# EasyEDA Pro project ProPrj_Desktop_Pet_Dog_V1.3.epro, board PCB5_1
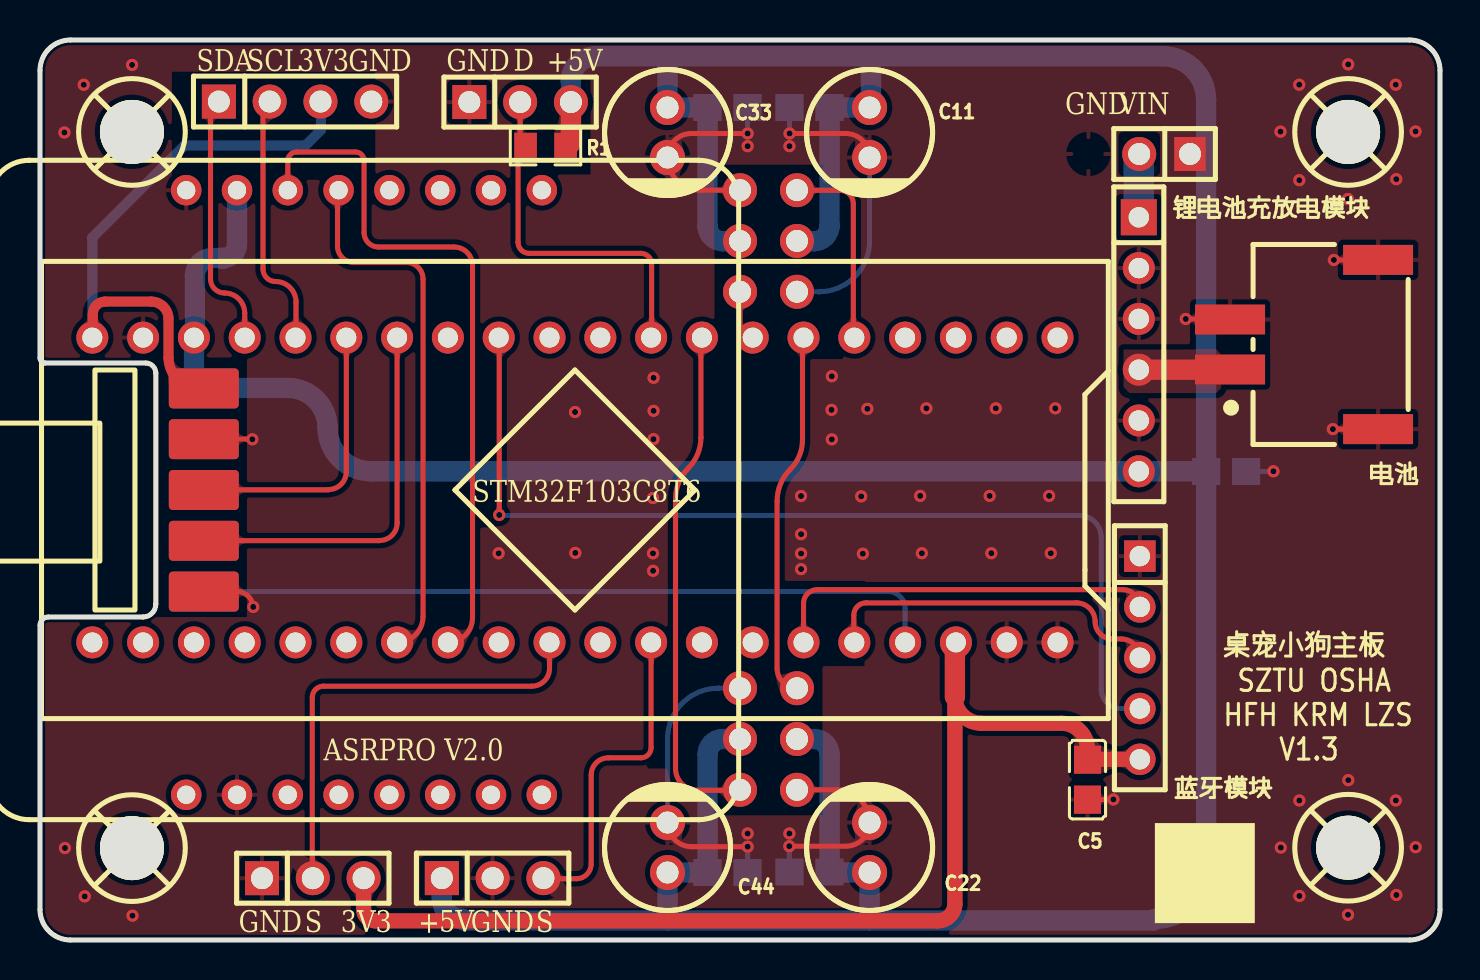
[diagram p5: board, top side]
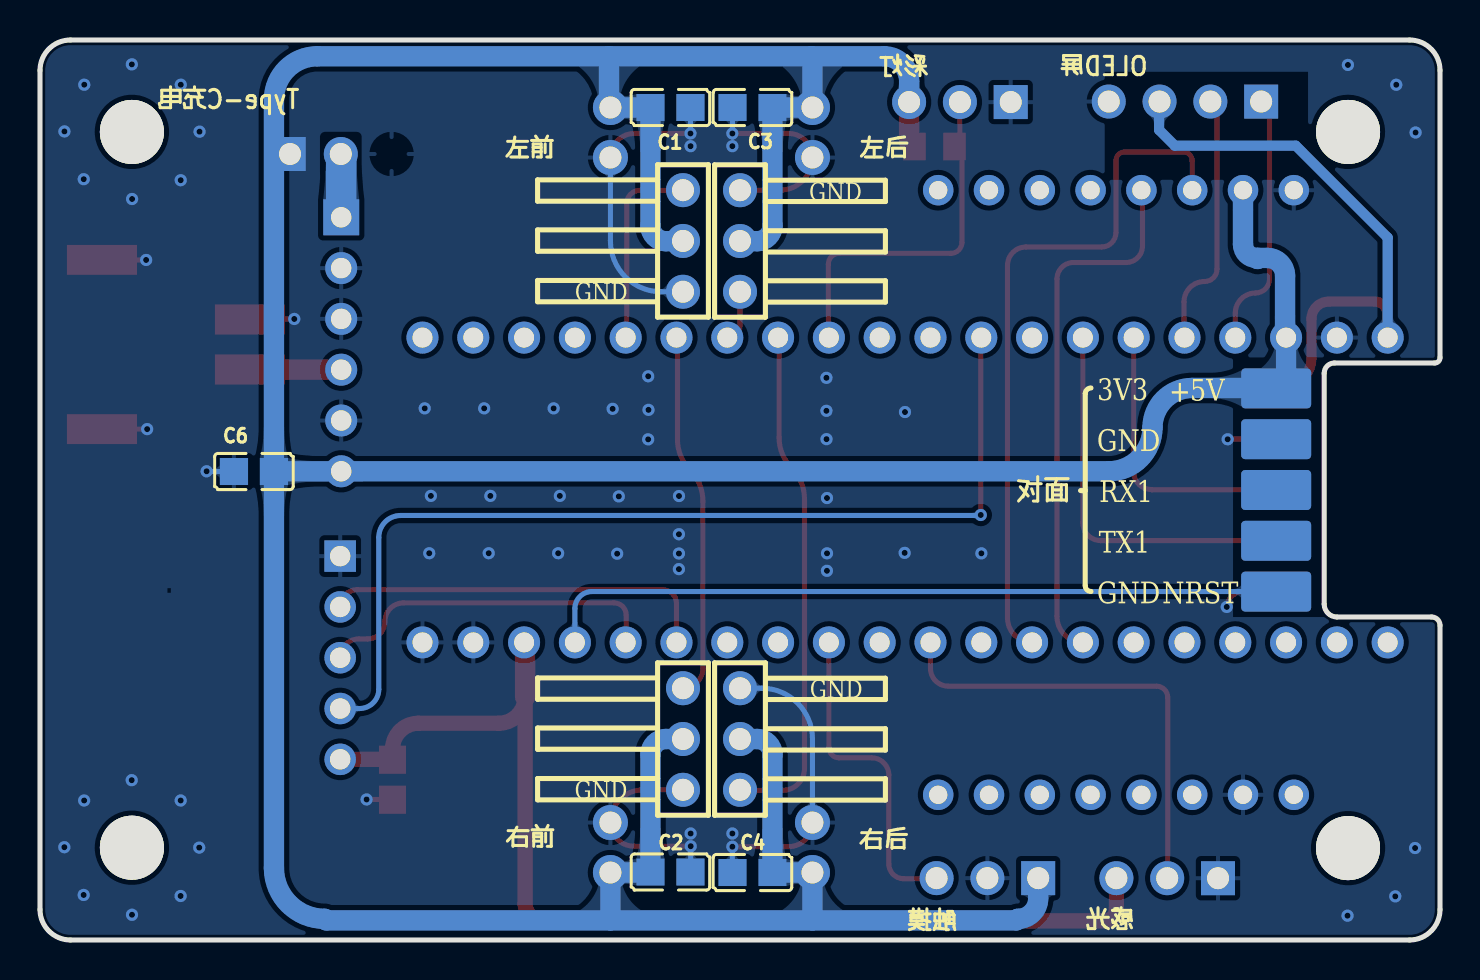
[diagram p6: board, bottom side, seen from below]

Outline 70 x 45 mm; copper layers: Top Layer, Bottom Layer. Coordinates in mm from the lower left corner of the outline.
Outline path: 0,43.48 0,29.11 arc(0.08,28.93) 0.26,28.85 5.28,28.85 arc(5.64,28.7) 5.79,28.34 5.79,16.8 arc(5.6,16.34) 5.15,16.15 0.42,16.15 arc(0.12,16.03) 0,15.73 0,1.52 arc(0.45,0.45) 1.52,0 68.48,0 arc(69.55,0.45) 70,1.52 70,43.48 arc(69.55,44.55) 68.48,45 1.52,45 arc(0.45,44.55) 0,43.48
Stack: Top Layer 0.035mm / Dielectric1 1.51mm FR4 er 4.5 / Bottom Layer 0.035mm

## Design rules (mm)
template: 自定义配置
spacing copperThickness1oz (default): track to track 0.102, other pairs 0 to 0.3
spacing copperThickness2oz: track to track 0.203, other pairs 0.152 to 0.3
track width copperThickness1oz (default): min 0.127, default 0.254, max 2.54
track width copperThickness2oz: min 0.203, default 0.254, max 2.54
differential pair differentialPair (default): width min 0.127, default 0.254, max 2.54; gap min 0.152, default 0.152
via viaSize (default): diameter min 0.5, default 0.61, max 10; hole min 0.3, default 0.305, max 6.3

## Placement (name value [footprint] x y rotation side)
C1  100nF  [C0805]  38.48 41.62 180 bottom
C2  100nF  [C0805]  38.48 3.4 180 bottom
C3  100nF  [C0805]  34.38 41.62 0 bottom
C4  100nF  [C0805]  34.38 3.37 0 bottom
C5  10uF  [C0805]  52.38 8.02 270 top
C6  100nF  [C0805]  59.3 23.42 0 bottom
C11  100uF  [CAP-TH_BD6.3-P2.50-D0.6-FD]  41.48 40.38 270 top
C22  100uF  [CAP-TH_BD6.3-P2.50-D0.6-FD]  41.48 4.62 90 top
C33  100uF  [CAP-TH_BD6.3-P2.50-D0.6-FD]  31.38 40.38 270 top
C44  100uF  [CAP-TH_BD6.3-P2.50-D0.6-FD]  31.38 4.62 90 top
H1  PZ254V-12-10P  [HDR-TH_10P-P2.54-V-M-R2-C5-S2.54]  1.36 22.5 90 bottom
OLED屏  -  [HDR-TH_4P-P2.54-V-M]  12.75 41.92 0 top
R1  4.7kΩ  [R0805]  25.28 39.67 180 top
SCREW1  -  [M3螺丝]  4.6 40.4 0 top
SCREW2  -  [M3螺丝]  65.41 40.4 0 top
SCREW3  -  [M3螺丝]  65.41 4.61 0 top
SCREW4  -  [M3螺丝]  4.6 4.59 0 top
Type-C充电  -  [单排针2P-2.54]  53.69 39.3 180 top
U1  STM32F103C8T6-Card  [CONN-TH_L53.3-W22.9_STM32F103C8T6-CARD]  26.75 22.5 180 top
U2  -  [天问模块]  16.2 22.5 0 top
U3  -  [JLC-QRCODE-5x5]  58.24 3.34 0 top
U4  -  [OSHA]  63.53 19.37 0 top
U5  -  [剑桥大学校徽]  109.56 21.79 180 bottom
右前  2.54-1*3P正弯针  [HDR-TH_3P-P2.54-H-M-BW7.2-P]  37.85 10.05 270 bottom
右后  2.54-1*3P正弯针  [HDR-TH_3P-P2.54-H-M-BW7.2-P]  35 10.05 90 bottom
左前  2.54-1*3P正弯针  [HDR-TH_3P-P2.54-H-M-BW7.2-P]  37.85 34.95 270 bottom
左后  2.54-1*3P正弯针  [HDR-TH_3P-P2.54-H-M-BW7.2-P]  35 34.95 90 bottom
彩灯  PZ254V-11-03P  [HDR-TH_3P-P2.54-V-M]  24.01 41.9 0 top
感光  PZ254V-11-03P  [HDR-TH_3P-P2.54-V-M]  13.64 3.09 0 top
电池  ZX-XH2.54-2PWT  [CONN-SMD_2P-P2.54_MEGASTAR_ZX-XH2.54-2PWT]  63.2 29.78 90 top
蓝牙模块  2.54-1*5P母  [HDR-TH_5P-P2.54-V-F]  54.99 14.11 270 top
触摸  PZ254V-11-03P  [HDR-TH_3P-P2.54-V-M]  22.63 3.09 0 top
锂电池充放电模块  PM254V-11-06-H85  [HDR-TH_6P-P2.54-V-F]  54.94 29.79 270 top

## Footprints (pads in the part's own frame, mm; a bottom-side part is the same pattern mirrored in y, then rotated)
C0805
  rect 1.41x1.35 smd: 1(-1,0) 2(1,0)
CAP-TH_BD6.3-P2.50-D0.6-FD
  round 1.75 hole 1.1: 1(-1.25,0) 2(1.25,0)
CONN-SMD_2P-P2.54_MEGASTAR_ZX-XH2.54-2PWT
  rect 1.5x3.5 smd: 1(-1.25,3.7) 2(1.25,3.7) 3(-4.23,-3.7) 4(4.23,-3.7)
CONN-TH_L53.3-W22.9_STM32F103C8T6-CARD
  round 1.6 hole 1: 1(-24.13,-7.62) 2(-21.59,-7.62) 3(-19.05,-7.62) 4(-16.51,-7.62) 5(-13.97,-7.62) 6(-11.43,-7.62) 7(-8.89,-7.62) 8(-6.35,-7.62) 9(-3.81,-7.62) 10(-1.27,-7.62) 11(1.27,-7.62) 12(3.81,-7.62) 13(6.35,-7.62) 14(8.89,-7.62) 15(11.43,-7.62) 16(13.97,-7.62) 17(16.51,-7.62) 18(19.05,-7.62) 19(21.59,-7.62) 20(24.13,-7.62) 21(24.13,7.62) 22(21.59,7.62) 23(19.05,7.62) 24(16.51,7.62) 25(13.97,7.62) 26(11.43,7.62) 27(8.89,7.62) 28(6.35,7.62) 29(3.81,7.62) 30(1.27,7.62) 31(-1.27,7.62) 32(-3.81,7.62) 33(-6.35,7.62) 34(-8.89,7.62) 35(-11.43,7.62) 36(-13.97,7.62) 37(-16.51,7.62) 38(-19.05,7.62) 39(-21.59,7.62) 40(-24.13,7.62)
HDR-TH_3P-P2.54-H-M-BW7.2-P
  round 1.7 hole 1.1: 1(-2.54,0) 2(0,0) 3(2.54,0)
HDR-TH_3P-P2.54-V-M
  rect 1.7x1.7 hole 1.1: 1(-2.54,0)
  round 1.7 hole 1.1: 2(0,0) 3(2.54,0)
HDR-TH_4P-P2.54-V-M
  rect 1.7x1.7 hole 1.1: 1(-3.81,0)
  round 1.7 hole 1.1: 2(-1.27,0) 3(1.27,0) 4(3.81,0)
HDR-TH_5P-P2.54-V-F
  rect 1.575x1.575 hole 1.02: 1(-5.08,0)
  round 1.575 hole 1.02: 2(-2.54,0) 3(0,0) 4(2.54,0) 5(5.08,0)
HDR-TH_6P-P2.54-V-F
  rect 1.8x1.8 hole 1.02: 1(-6.35,0)
  round 1.6 hole 1.02: 2(-3.81,0) 3(-1.27,0) 4(1.27,0) 5(3.81,0) 6(6.35,0)
HDR-TH_10P-P2.54-V-M-R2-C5-S2.54
  rrect 2x3.5 smd: 1(5.08,6.832) 3(2.54,6.832) 5(0,6.832) 7(-2.54,6.832) 9(-5.08,6.832)
  rrect 2x3.5 smd far side: 2(5.08,6.832) 4(2.54,6.832) 6(0,6.832) 8(-2.54,6.832) 10(-5.08,6.832)
M3螺丝
  round 3.2 hole 3.2: 1(0,0)
R0805
  rect 1.133x1.377 smd: 1(-1,0) 2(1,0)
单排针2P-2.54
  rect 1.575x1.7 hole 1.1: 1(-3.81,0)
  round 1.7 hole 1.1: 2(-1.27,0)
天问模块
  round 1.524 hole 0.914: 1(-8.89,-15.24) 2(-6.35,-15.24) 3(-3.81,-15.24) 4(-1.27,-15.24) 5(1.27,-15.24) 6(3.81,-15.24) 7(6.35,-15.24) 8(8.89,-15.24) 9(8.89,14.99) 10(6.35,14.99) 11(3.81,14.99) 12(1.27,14.99) 13(-1.27,14.99) 14(-3.81,14.99) 15(-6.35,14.99) 16(-8.89,14.99)

## Nets
As in the schematic.

Pads without a net: H1 3 5 7; SCREW1 1; SCREW2 1; SCREW3 1; SCREW4 1; U1 1 10 11 21 22 23 24 26; U2 1 3 4 5 6 7 8 9 10 11 12

## Via types
v1: diameter 0.61, hole 0.305, Top Layer to Bottom Layer, 66 vias

## Routing (per net, layer and track width the routed paths; a pad name or vN(x,y) marks a point on that pad's centre or on a via; arc(x,y) is an arc through that point)
3V3_BT: length 56.4
  Top Layer w0.762: 55.12,9.03 52.37,9.03 52.37,9.54 arc(51.99,10.46) 51.08,10.84 47.07,10.84 arc(46.13,11.22) 45.75,12.16 45.75,1.82 arc(45.49,1.21) 44.88,0.96 16.76,0.96 arc(16.35,1.13) 16.18,1.54 感光.3
  Top Layer w1.016: 45.75,14.88 45.75,12.16
3V3_OLED: length 30.5
  Top Layer w0.508: 8.19,27.59 7.96,27.59 arc(6.88,28.04) 6.43,29.12 6.43,31.06 arc(6.17,31.67) 5.56,31.92 3.25,31.92 arc(2.82,31.74) 2.64,31.31 2.64,30.15 arc(2.63,30.13) U1.20
  Bottom Layer w0.508: OLED屏.3 14.05,41.9 14.05,40.5 13.26,39.72 7.21,39.72 2.62,35.12 U1.20
+5V: length 231.2
  Top Layer w1.016: 彩灯.3 26.55,39.94 arc(26.47,39.75) R1.1
  Bottom Layer w1.016: 35,10.05 34.14,10.05 arc(33.6,9.83) 33.38,9.29 C4.1 C44.1 31.38,0.99 arc(31.38,0.98) 31.38,0.98 ; 20.09,3.32 20.09,2.07 arc(20.39,1.36) 21.11,1.06 21.18,0.98 31.38,0.98 ; U2.15 9.85,34.78 arc(9.65,34.3) 9.17,34.1 9.12,34.05 9.07,34.1 8.64,34.1 arc(8.01,33.84) 7.75,33.21 7.75,30.17 arc(7.73,30.13) U1.18 7.7,28.08 arc(7.84,27.73) 8.19,27.59 arc(8.2,27.6) 8.2,27.6 12.39,27.6 arc(13.8,27.02) 14.38,25.62 arc(15.02,24.08) 16.56,23.44 锂电池充放电模块.6 58.29,23.44 arc(58.3,23.43) C6.1 ; 37.85,10.05 38.71,10.05 arc(39.25,9.83) 39.48,9.28 C2.1 arc(39.48,3.38) 39.5,3.37 C22.1 41.48,0.99 arc(41.48,0.98) 41.47,0.98 ; 41.55,44.19 41.55,41.69 arc(41.53,41.65) C11.1 C1.1 39.48,35.71 arc(39.25,35.17) 38.71,34.94 37.86,34.94 arc(37.85,34.94) 左前.2 ; 41.55,44.19 56.13,44.19 arc(57.67,43.55) 58.3,42.02 C6.1 ; 41.55,44.19 31.42,44.19 ; C6.1 58.3,3.6 arc(57.56,1.8) 55.76,1.06 55.69,0.98 41.47,0.98 ; 31.38,0.98 41.47,0.98 ; 31.42,44.19 27.79,44.19 arc(26.91,43.82) 26.54,42.94 26.54,41.9 arc(26.54,41.9) 彩灯.3 ; 31.42,44.19 arc(31.39,44.17) 31.38,44.14 C33.1 C3.1 33.38,35.7 arc(33.6,35.16) 34.14,34.94 34.99,34.94 arc(35,34.94) 左后.2
GND: length 66.6
  Top Layer w0.254: 8.19,17.43 9.82,17.43 arc(10.39,17.21) v1(10.66,16.65) ; v1(37.48,40.33) 40.28,40.33 arc(41.13,39.97) C11.2 ; v1(37.47,4.69) 40.3,4.69 arc(41.13,5.04) C22.2 arc(41,7.03) 39.84,7.51 右前.3 ; v1(57.29,31.05) 59.49,31.05 arc(59.5,31.05) 59.5,31.06 ; v1(35.38,4.67) 32.59,4.67 arc(31.73,5.02) C44.2 ; v1(35.38,40.33) 32.58,40.33 arc(31.73,39.97) C33.2 arc(31.86,37.97) 33.01,37.49 左后.3 ; v1(53.67,7.03) 52.38,7.03 arc(52.38,7.02) C5.2 ; 8.19,25.05 10.6,25.05 arc(10.61,25.04) v1(10.62,25.04) ; v1(64.69,34) 66.9,34 arc(66.9,34) 电池.4 ; v1(64.64,25.54) 66.9,25.54
  Bottom Layer w0.254: v1(37.47,4.69) 37.47,3.41 arc(37.47,3.4) C2.2 ; C3.2 35.38,40.15 arc(35.4,40.24) v1(35.38,40.33) ; 左前.3 38.94,32.41 arc(40.74,33.16) 41.48,34.95 C11.2 ; 35,12.59 33.92,12.59 arc(32.12,11.85) 31.38,10.05 C44.2 ; C6.2 61.66,23.42 arc(61.67,23.43) v1(61.67,23.44) ; C1.2 v1(37.48,40.33) ; v1(35.38,4.67) 35.38,3.38 arc(35.38,3.38) C4.2
  vias: v1(1.22,40.37) v1(1.25,4.6) v1(2.19,42.76) v1(2.24,2.18) v1(4.6,43.75) v1(4.62,1.22) v1(22.93,19.33) v1(26.75,26.4) v1(26.77,19.36) v1(30.65,19.33) v1(30.68,28.11) v1(30.68,26.46) v1(30.67,25.04) v1(30.65,22.1) v1(30.65,18.46) v1(35.38,39.69) v1(35.38,5.33) v1(37.47,39.69) v1(37.47,5.33) v1(38.05,22.2) v1(38.05,20.29) v1(38.05,19.32) v1(38.05,18.54) v1(39.59,28.19) v1(39.58,26.51) v1(39.59,25.03) v1(41.06,22.18) v1(41.14,19.31) v1(41.37,26.56) v1(44.01,22.2) v1(44.09,19.34) v1(44.32,26.58) v1(47.48,22.2) v1(47.57,19.34) v1(47.79,26.58) v1(50.46,22.2) v1(50.54,19.34) v1(50.76,26.58) v1(62.02,40.42) v1(62.04,4.62) v1(62.96,42.77) v1(62.97,37.99) v1(62.97,6.98) v1(62.97,2.2) v1(65.41,43.78) v1(65.4,37.05) v1(65.41,7.99) v1(65.4,1.26) v1(67.79,42.77) v1(67.81,38.04) v1(67.79,6.98) v1(67.82,2.25) v1(68.78,40.43) v1(68.78,4.64)
VIN: length 3.2
  Bottom Layer w1.524: 锂电池充放电模块.1 54.94,39.28 arc(54.95,39.29) 54.96,39.3
ASRPRO_RX: length 26.9
  Top Layer w0.254: U2.13 arc(14.89,37.48) 14.88,37.44 14.88,34.7 arc(15.12,34.12) 15.7,33.87 18.33,33.87 arc(18.91,33.63) 19.15,33.05 19.15,16.17 arc(18.77,15.26) U1.27
ASRPRO_TX: length 35.3
  Top Layer w0.254: U2.14 12.39,38.96 arc(12.52,39.27) 12.83,39.4 15.78,39.4 arc(16.08,39.28) 16.2,38.97 16.2,35.37 arc(16.41,34.86) 16.93,34.65 20.7,34.65 arc(21.36,34.38) 21.63,33.72 21.63,16.11 arc(21.27,15.24) U1.28
BAT: length 4.4
  Top Layer w1.016: 55.12,28.52 59.49,28.52 arc(59.5,28.52) 电池.1
BLT_PB4: length 49.7
  Top Layer w0.254: v1(22.96,21.25) 22.96,30.09 arc(22.95,30.11) U1.12
  Bottom Layer w0.254: 蓝牙模块.4 54.03,11.57 arc(53.34,11.86) 53.06,12.54 53.06,20.13 arc(52.74,20.91) 51.97,21.23 22.99,21.23 arc(22.97,21.23) v1(22.96,21.25)
FLOW_LED: length 18.4
  Top Layer w0.254: 彩灯.2 24.01,39.95 arc(24.08,39.75) R1.2 arc(24.01,39.56) 23.9,39.3 23.9,34.89 arc(24.07,34.5) 24.46,34.33 30.05,34.33 arc(30.43,34.18) 30.58,33.8 30.58,30.15 arc(30.57,30.13) U1.9
I2C_CLK: length 12.9
  Top Layer w0.254: U1.16 arc(12.79,30.13) 12.8,30.14 12.8,31.9 arc(12.5,32.62) 11.78,32.92 arc(11.33,33.11) 11.15,33.55 11.15,41.59 arc(11.25,41.82) OLED屏.2
I2C_SDA: length 13
  Top Layer w0.254: U1.17 10.24,31.34 arc(9.94,32.05) 9.23,32.35 arc(8.73,32.55) 8.53,33.05 8.53,41.5 arc(8.65,41.8) OLED屏.1
LIGHT: length 23
  Top Layer w0.254: U1.30 25.48,13.58 arc(25.22,12.95) 24.59,12.69 14.17,12.69 arc(13.78,12.53) 13.61,12.13 13.61,3.12 arc(13.62,3.1) 感光.2
NRST: length 37.2
  Bottom Layer w0.254: U1.37 43.26,16.57 arc(43.01,17.17) 42.4,17.42 8.2,17.42 arc(8.19,17.42) 8.19,17.43
RX1_DEBUG: length 14.3
  Top Layer w0.254: U1.15 15.32,23.41 arc(15.06,22.78) 14.43,22.52 arc(14.42,22.51) 14.41,22.51 8.19,22.51
RX3_TO_BT: length 17.6
  Top Layer w0.254: U1.36 arc(40.7,14.89) 40.69,14.91 40.69,16.25 arc(40.87,16.68) 41.3,16.86 51.82,16.86 arc(52.48,16.58) 52.76,15.92 arc(53.01,15.31) 53.62,15.05 54.05,15.05 arc(54.72,14.78) 蓝牙模块.3
SERVO1: length 9.9
  Top Layer w0.254: 40.67,30.12 40.67,36.82 arc(40.47,37.29) 40,37.48 37.86,37.48 arc(37.85,37.48) 左前.1
SERVO2: length 18.4
  Top Layer w0.254: 38.13,30.12 38.13,25.01 arc(37.97,24.21) 37.52,23.54 arc(37.03,22.81) 36.86,21.94 36.86,13.58 arc(37.15,12.88) 37.85,12.59
SERVO3: length 2.6
  Top Layer w0.254: 左后.1 35,30.71 arc(35.17,30.29) 35.59,30.12
SERVO4: length 25.7
  Top Layer w0.254: 33.05,30.12 33.05,25.12 arc(32.88,24.29) 32.41,23.59 arc(31.94,22.88) 31.78,22.06 31.78,8.58 arc(32.1,7.8) 32.87,7.48 34.97,7.48 arc(34.99,7.49) 右后.1
TOUCH: length 16.3
  Top Layer w0.254: U1.32 30.56,9.62 arc(30.41,9.26) 30.05,9.11 28.42,9.11 arc(27.81,8.86) 27.56,8.25 27.56,3.8 arc(27.34,3.28) 26.82,3.06 25.2,3.06 arc(25.18,3.07) 触摸.3
TX1_DEBUG: length 19.4
  Top Layer w0.254: U1.14 17.86,20.85 arc(17.6,20.23) 16.98,19.97 arc(16.97,19.97) 16.97,19.97 8.19,19.97
TX3_TO_BT: length 19.8
  Top Layer w0.254: U1.35 38.18,16.83 arc(38.38,17.32) 38.86,17.52 54.13,17.52 arc(54.74,17.26) 蓝牙模块.2 55.12,16.65

## Copper pours and planes (outline as drawn; the poured copper is in the pictures)
GND on Top Layer: -1.65,45.83 71.4,45.83 71.4,-1.43 -1.65,-1.43
GND on Bottom Layer: -0.9,45.88 72.28,45.88 72.28,-0.88 -0.9,-0.88
BAT on Top Layer: 54.18,29.53 59.06,29.53 59.06,27.35 54.18,27.35

Small or netless copper shapes (teardrops, artwork), in the pictures only: 71 on Top Layer, 55 on Bottom Layer

## Text on the board
Bottom Silkscreen Layer: GND | +5V | NRST | RX1 | TX1 | 3V3 | 对面
Top Silkscreen Layer: 桌宠小狗主板 / SZTU OSHA / HFH KRM LZS / V1.3 | ASRPRO V2.0 | STM32F103C8T6 | SDA | GND | SCL | 3V3 | S | +5V | D | VIN
